# Altium schematic sheet ESP-LF.SchDoc
size A4; SheetNumber: 1; SheetTotal: 6
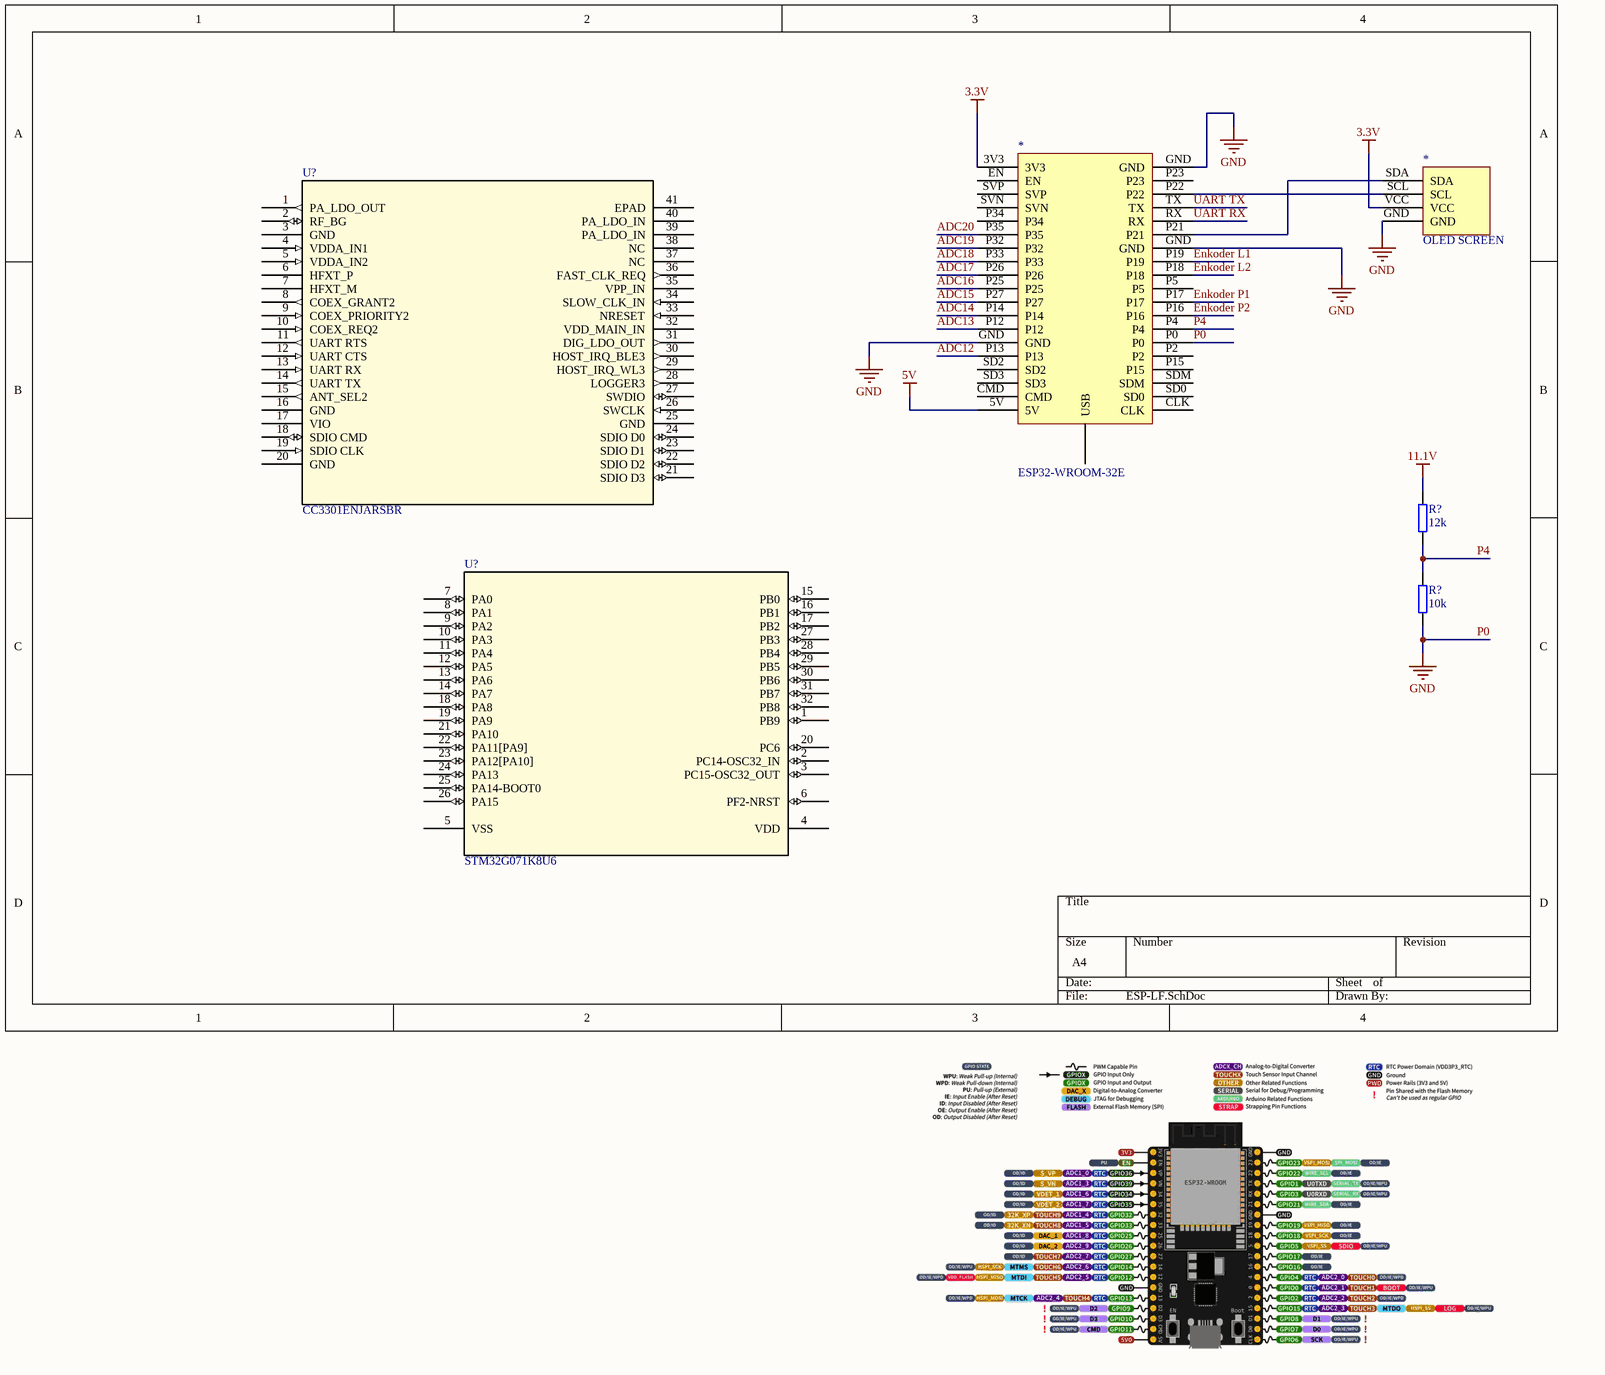
[diagram p0: ESP-LF.SchDoc]

## Parts
(Parts that share a designator on the sheet are numbered #1, #2 ... from top to bottom, then left to right.)
*#1  ESP32-WROOM-32E
*#2  OLED SCREEN
R?#1  12k  [R 0603]
R?#2  10k  [R 0603]
U?#1  CC3301ENJARSBR  [WQFN_JARSBR_TEX]
U?#2  STM32G071K8U6  [UFQFPN-32]

## Nets
3.3V: *#1.3V3 *#2.VCC
5V: *#1.5V
11.1V: R?#1.2
P0: *#1.GND *#1.P0 *#2.GND R?#2.1  [also labelled GND]
ADC12: *#1.P13
ADC13: *#1.P12
ADC14: *#1.P14
ADC15: *#1.P27
ADC16: *#1.P25
ADC17: *#1.P26
ADC18: *#1.P33
ADC19: *#1.P32
ADC20: *#1.P35
Enkoder L1: *#1.P19
Enkoder L2: *#1.P18
Enkoder P1: *#1.P17
Enkoder P2: *#1.P16
P4: *#1.P4 R?#1.1 R?#2.2
UART RX: *#1.RX
UART TX: *#1.TX
Net*#1_P21: *#1.P21 *#2.SDA
Net*#1_P22: *#1.P22 *#2.SCL

Not connected (* = marked no-connect by the designer): *#1 CLK CMD EN P2 P5 P15 P23 P34 SD0 SD2 SD3 SDM SVN SVP USB; U?#1 1(PA_LDO_OUT) 2(RF_BG) 3(GND) 4(VDDA_IN1) 5(VDDA_IN2) 6(HFXT_P) 7(HFXT_M) 8(COEX_GRANT2) 9(COEX_PRIORITY2) 10(COEX_REQ2) 11(UART_RTS) 12(UART_CTS) 13(UART_RX) 14(UART_TX) 15(ANT_SEL2) 16(GND) 17(VIO) 18(SDIO_CMD) 19(SDIO_CLK) 20(GND) 21(SDIO_D3) 22(SDIO_D2) 23(SDIO_D1) 24(SDIO_D0) 25(GND) 26(SWCLK) 27(SWDIO) 28(LOGGER3) 29(HOST_IRQ_WL3) 30(HOST_IRQ_BLE3) 31(DIG_LDO_OUT) 32(VDD_MAIN_IN) 33(NRESET) 34(SLOW_CLK_IN) 35(VPP_IN) 36(FAST_CLK_REQ) 37(NC) 38(NC) 39(PA_LDO_IN) 40(PA_LDO_IN) 41(EPAD); U?#2 1(PB9) 2(PC14-OSC32_IN) 3(PC15-OSC32_OUT) 4(VDD) 5(VSS) 6(PF2-NRST) 7(PA0) 8(PA1) 9(PA2) 10(PA3) 11(PA4) 12(PA5) 13(PA6) 14(PA7) 15(PB0) 16(PB1) 17(PB2) 18(PA8) 19(PA9) 20(PC6) 21(PA10) 22(PA11[PA9]) 23(PA12[PA10]) 24(PA13) 25(PA14-BOOT0) 26(PA15) 27(PB3) 28(PB4) 29(PB5) 30(PB6) 31(PB7) 32(PB8)

## Library data of the parts
R?#1 R?#2 = Resistor: General pourpouse resistor
U?#1 = CC3301ENJARSBR: No Description Available; Mfr_Name: Texas Instruments; Type: RF Transceiver ICs; RefDes: RefDes
U?#2 = STM32G071K8U6: No Description Available; Mfr_Name: STMicroelectronics; Copyright: Copyright (C) 2024 Ultra Librarian. All rights reserved.; Manufacturer_Part_Number: STM32G071K8U6; RefDes: RefDes; Type: DEV